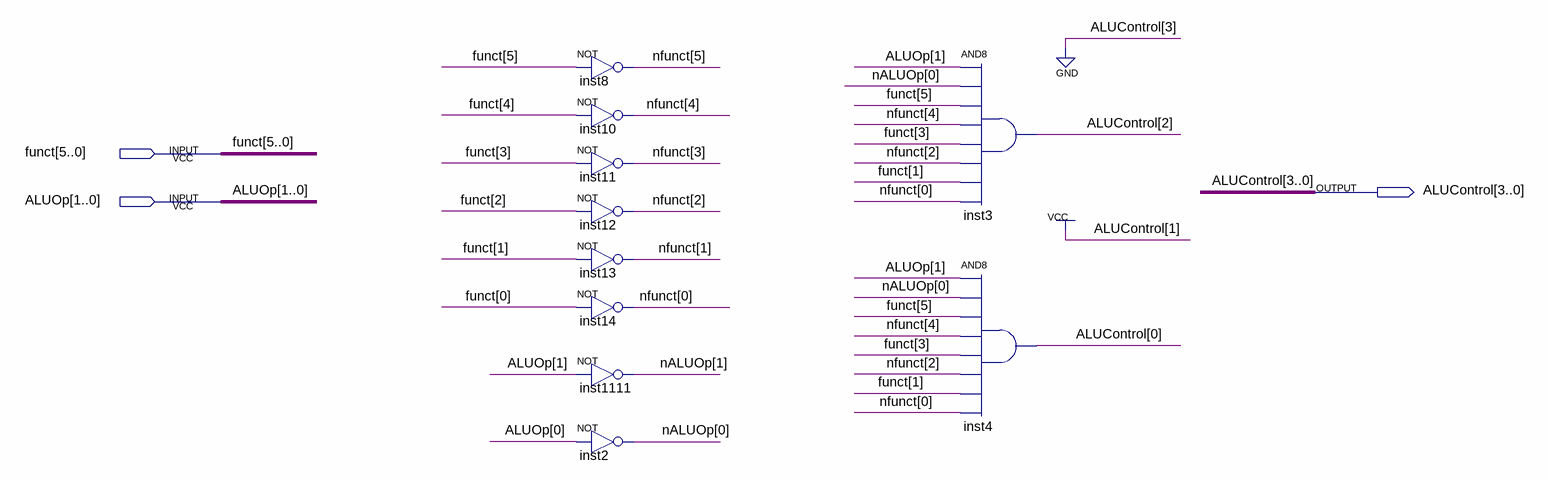
[diagram p0: schematic sheet]
// Quartus schematic ALUcontrol.bdf as structural Verilog: 10 symbols, 3 pins
module ALUcontrol (
  input  [5:0] funct,
  input  [1:0] ALUOp,
  output [3:0] ALUControl
);

  wire [1:0] nALUOp;
  wire [5:0] nfunct;

  not inst8 (nfunct[5], funct[5]);
  not inst10 (nfunct[4], funct[4]);
  not inst11 (nfunct[3], funct[3]);
  not inst12 (nfunct[2], funct[2]);
  not inst13 (nfunct[1], funct[1]);
  not inst14 (nfunct[0], funct[0]);
  not inst1111 (nALUOp[1], ALUOp[1]);
  not inst2 (nALUOp[0], ALUOp[0]);
  and inst3 (ALUControl[2], ALUOp[1], nALUOp[0], funct[5], nfunct[4], funct[3], nfunct[2], funct[1], nfunct[0]);
  and inst4 (ALUControl[0], ALUOp[1], nALUOp[0], funct[5], nfunct[4], funct[3], nfunct[2], funct[1], nfunct[0]);

  assign {ALUControl[3], ALUControl[1]} = 2'b01;
endmodule
